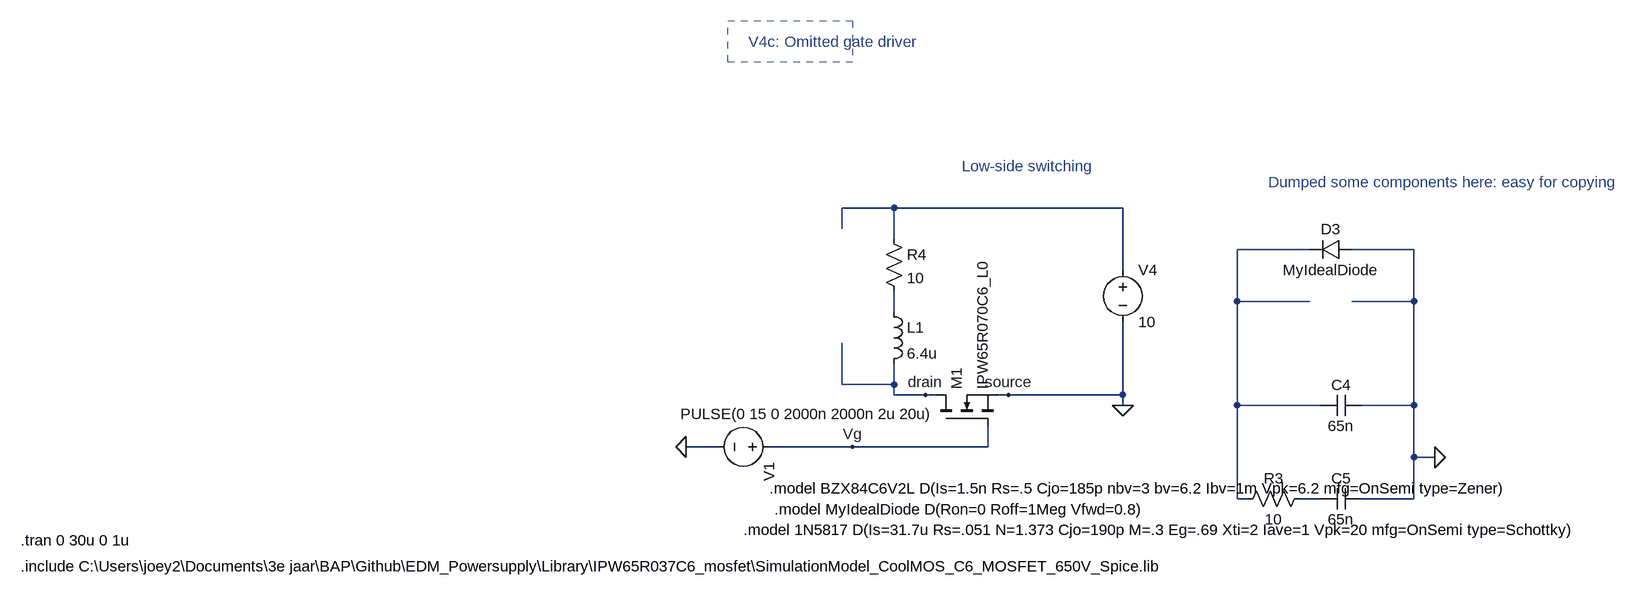
[diagram p0: schematic EDM_Powersupply_V4c_noGD.asc]
EDM_Powersupply_V4c_noGD.asc, the LTspice schematic file:
Version 4
SHEET 1 1876 680
WIRE 624 -32 544 -32
WIRE 976 -32 624 -32
WIRE 544 0 544 -32
WIRE 624 16 624 -32
WIRE 1264 32 1152 32
WIRE 1424 32 1328 32
WIRE 976 64 976 -32
WIRE 1152 112 1152 32
WIRE 1264 112 1152 112
WIRE 1424 112 1424 32
WIRE 1424 112 1328 112
WIRE 624 128 624 96
WIRE 544 240 544 176
WIRE 624 240 624 208
WIRE 624 240 544 240
WIRE 624 256 624 240
WIRE 672 256 624 256
WIRE 688 256 672 256
WIRE 800 256 784 256
WIRE 976 256 976 144
WIRE 976 256 800 256
WIRE 976 272 976 256
WIRE 1152 272 1152 112
WIRE 1280 272 1152 272
WIRE 1424 272 1424 112
WIRE 1424 272 1344 272
WIRE 352 336 304 336
WIRE 560 336 432 336
WIRE 768 336 768 304
WIRE 768 336 560 336
WIRE 1424 352 1424 272
WIRE 1456 352 1424 352
WIRE 1152 416 1152 272
WIRE 1168 416 1152 416
WIRE 1280 416 1248 416
WIRE 1424 416 1424 352
WIRE 1424 416 1344 416
FLAG 304 336 0
FLAG 560 336 Vg
FLAG 672 256 drain
FLAG 800 256 source
FLAG 976 272 0
FLAG 1456 352 0
SYMBOL voltage 448 336 R90
WINDOW 123 0 0 Left 0
WINDOW 39 0 0 Left 0
WINDOW 3 -51 153 VLeft 2
SYMATTR Value PULSE(0 15 0 2000n 2000n 2u 20u)
SYMATTR InstName V1
SYMBOL res 608 0 R0
SYMATTR InstName R4
SYMATTR Value 10
SYMBOL voltage 976 48 R0
WINDOW 123 0 0 Left 0
WINDOW 39 0 0 Left 0
SYMATTR InstName V4
SYMATTR Value 10
SYMBOL nmos 688 304 R270
SYMATTR InstName M1
SYMATTR Value IPW65R070C6_L0
SYMATTR Prefix X
SYMBOL cap 1344 256 R90
WINDOW 0 0 32 VBottom 2
WINDOW 3 32 32 VTop 2
SYMATTR InstName C4
SYMATTR Value 65n
SYMBOL cap 1344 400 R90
WINDOW 0 0 32 VBottom 2
WINDOW 3 32 32 VTop 2
SYMATTR InstName C5
SYMATTR Value 65n
SYMBOL res 1264 400 R90
WINDOW 0 0 56 VBottom 2
WINDOW 3 32 56 VTop 2
SYMATTR InstName R3
SYMATTR Value 10
SYMBOL diode 1328 16 R90
WINDOW 0 0 32 VBottom 2
WINDOW 3 32 32 VTop 2
SYMATTR InstName D3
SYMATTR Value MyIdealDiode
SYMBOL ind 608 112 R0
SYMATTR InstName L1
SYMATTR Value 6.4u
TEXT -720 520 Left 2 !.include C:\\Users\\joey2\\Documents\\3e jaar\\BAP\\Github\\EDM_Powersupply\\Library\\IPW65R037C6_mosfet\\SimulationModel_CoolMOS_C6_MOSFET_650V_Spice.lib
TEXT -720 480 Left 2 !.tran 0 30u 0 1u
TEXT 728 -96 Left 2 ;Low-side switching
TEXT 392 464 Left 2 !.model 1N5817 D(Is=31.7u Rs=.051 N=1.373 Cjo=190p M=.3 Eg=.69 Xti=2 Iave=1 Vpk=20 mfg=OnSemi type=Schottky)
TEXT 1200 -72 Left 2 ;Dumped some components here: easy for copying
TEXT 432 400 Left 2 !.model BZX84C6V2L D(Is=1.5n Rs=.5 Cjo=185p nbv=3 bv=6.2 Ibv=1m Vpk=6.2 mfg=OnSemi type=Zener)
TEXT 440 432 Left 2 !.model MyIdealDiode D(Ron=0 Roff=1Meg Vfwd=0.8)
TEXT 400 -288 Left 2 ;V4c: Omitted gate driver
RECTANGLE Normal 560 -256 368 -320 2

The netlist it stands for:
* EDM_Powersupply_V4c_noGD.asc
V1 Vg 0 PULSE(0 15 0 2000n 2000n 2u 20u)
R4 N001 N003 10
V4 N001 0 10
XM1 drain Vg 0 IPW65R070C6_L0  ; pins D G S
C4 0 N002 65n
C5 0 N004 65n
R3 N004 N002 10
D3 0 N002 MyIdealDiode
L1 N003 drain 6.4u
.model D D
.lib standard.dio
.include C:\Users\joey2\Documents\3e jaar\BAP\Github\EDM_Powersupply\Library\IPW65R037C6_mosfet\SimulationModel_CoolMOS_C6_MOSFET_650V_Spice.lib
.tran 0 30u 0 1u
* Low-side switching
.model 1N5817 D(Is=31.7u Rs=.051 N=1.373 Cjo=190p M=.3 Eg=.69 Xti=2 Iave=1 Vpk=20 mfg=OnSemi type=Schottky)
* Dumped some components here: easy for copying
.model BZX84C6V2L D(Is=1.5n Rs=.5 Cjo=185p nbv=3 bv=6.2 Ibv=1m Vpk=6.2 mfg=OnSemi type=Zener)
.model MyIdealDiode D(Ron=0 Roff=1Meg Vfwd=0.8)
* V4c: Omitted gate driver
.backanno
.end